# EAGLE schematic 612_jetracer_328_211 (EAGLE 9.6.0)
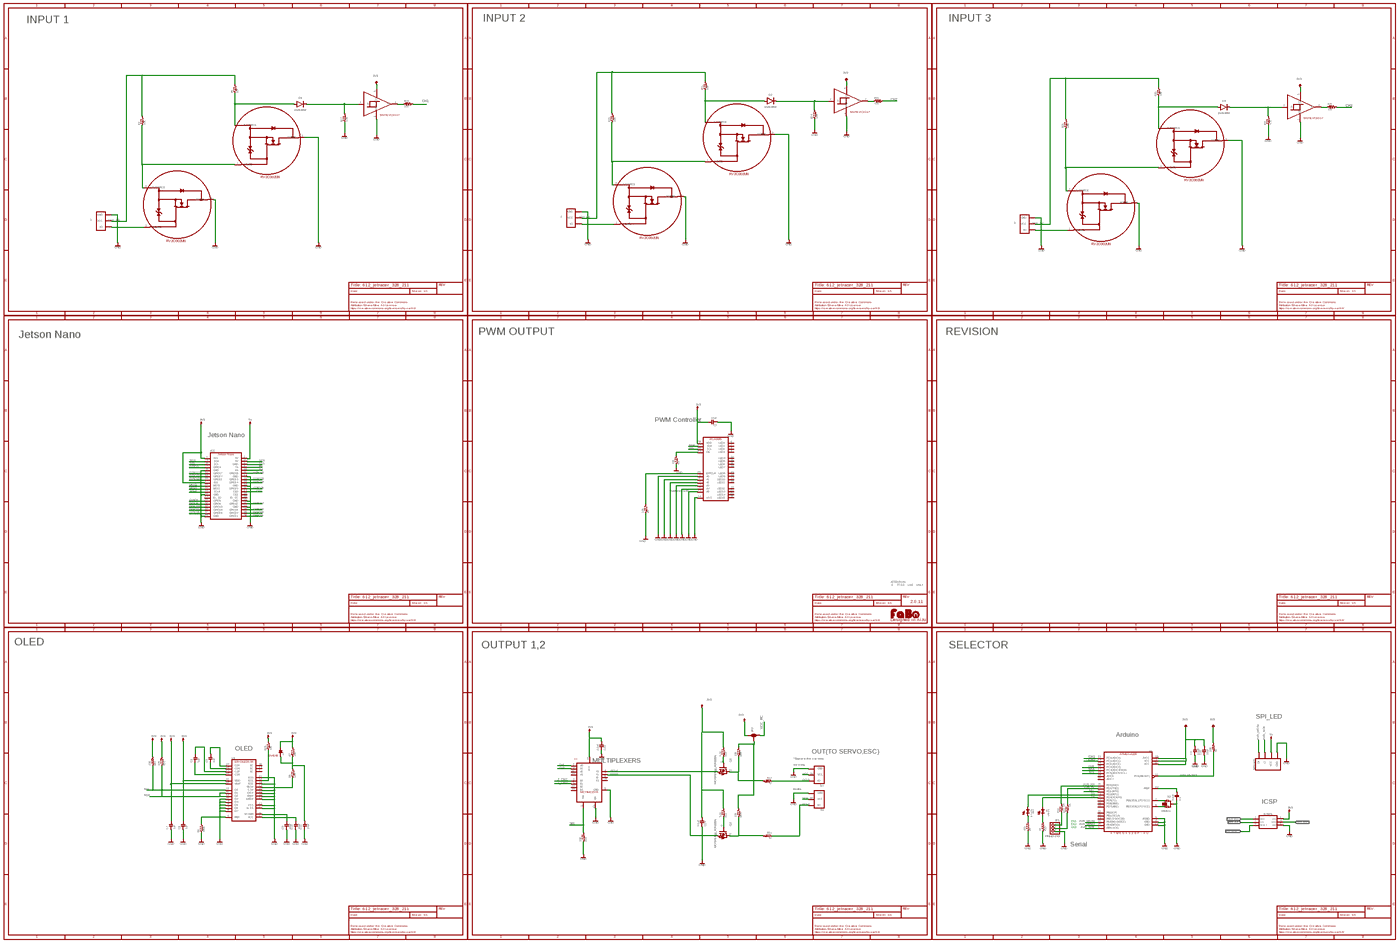
[diagram p0: schematic, sheet 1, overview]
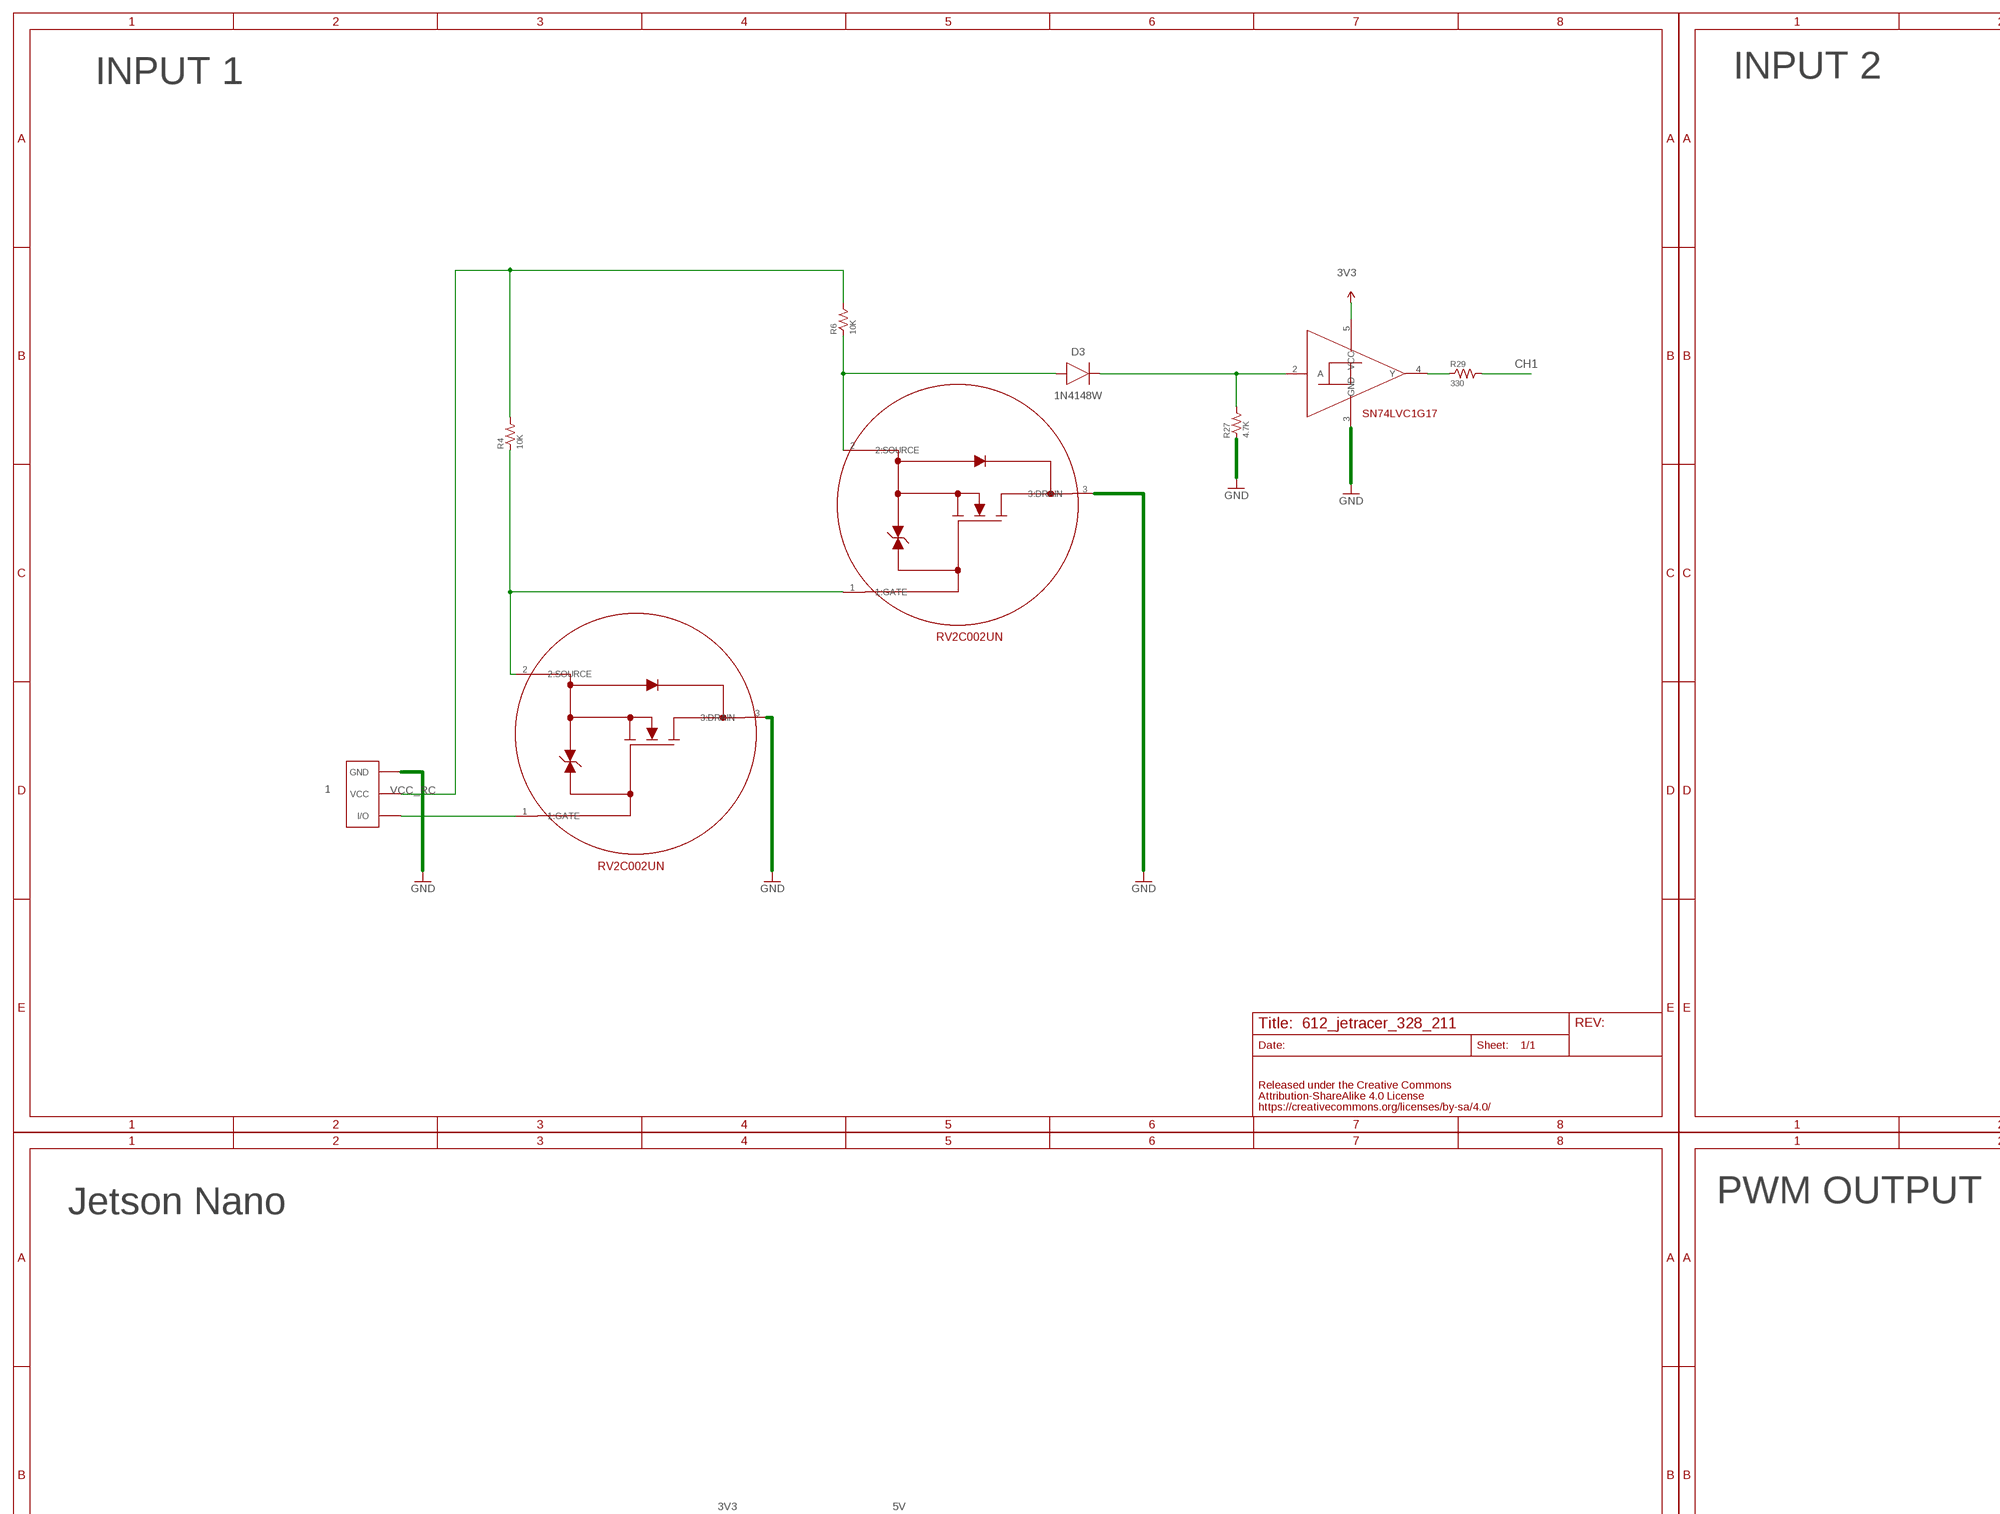
[diagram p1: schematic, sheet 1, part 1 of 6]
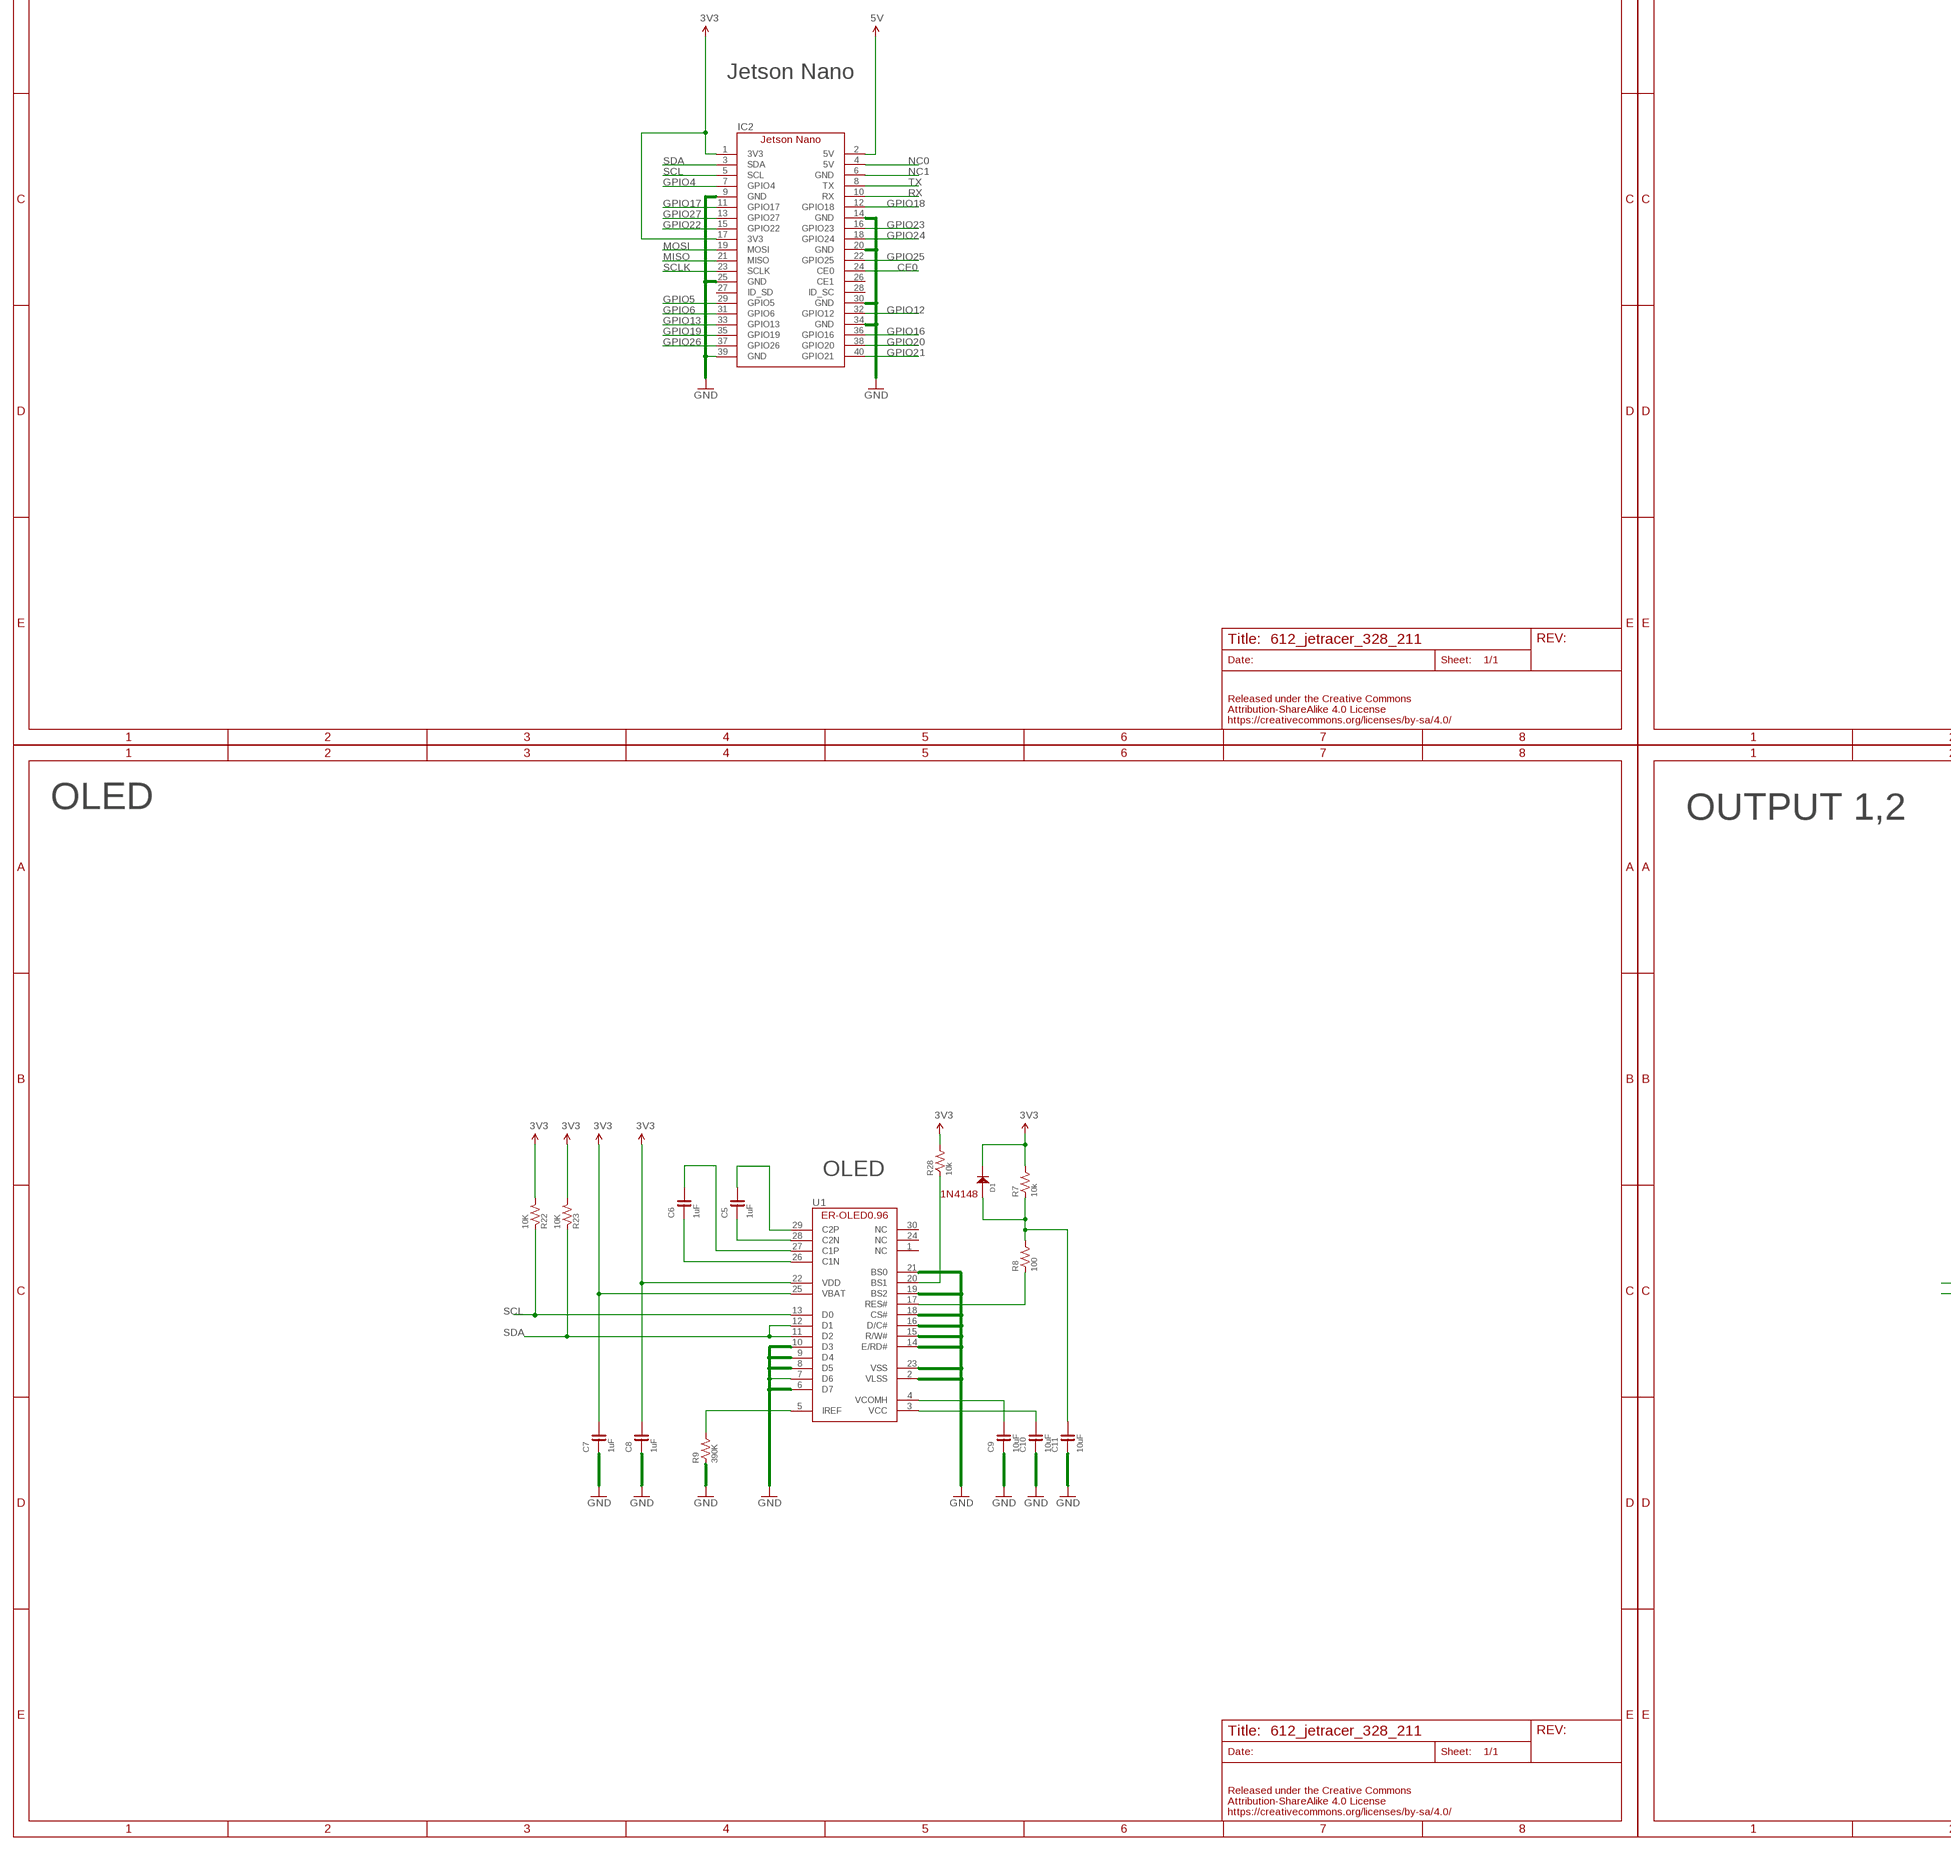
[diagram p2: schematic, sheet 1, part 2 of 6]
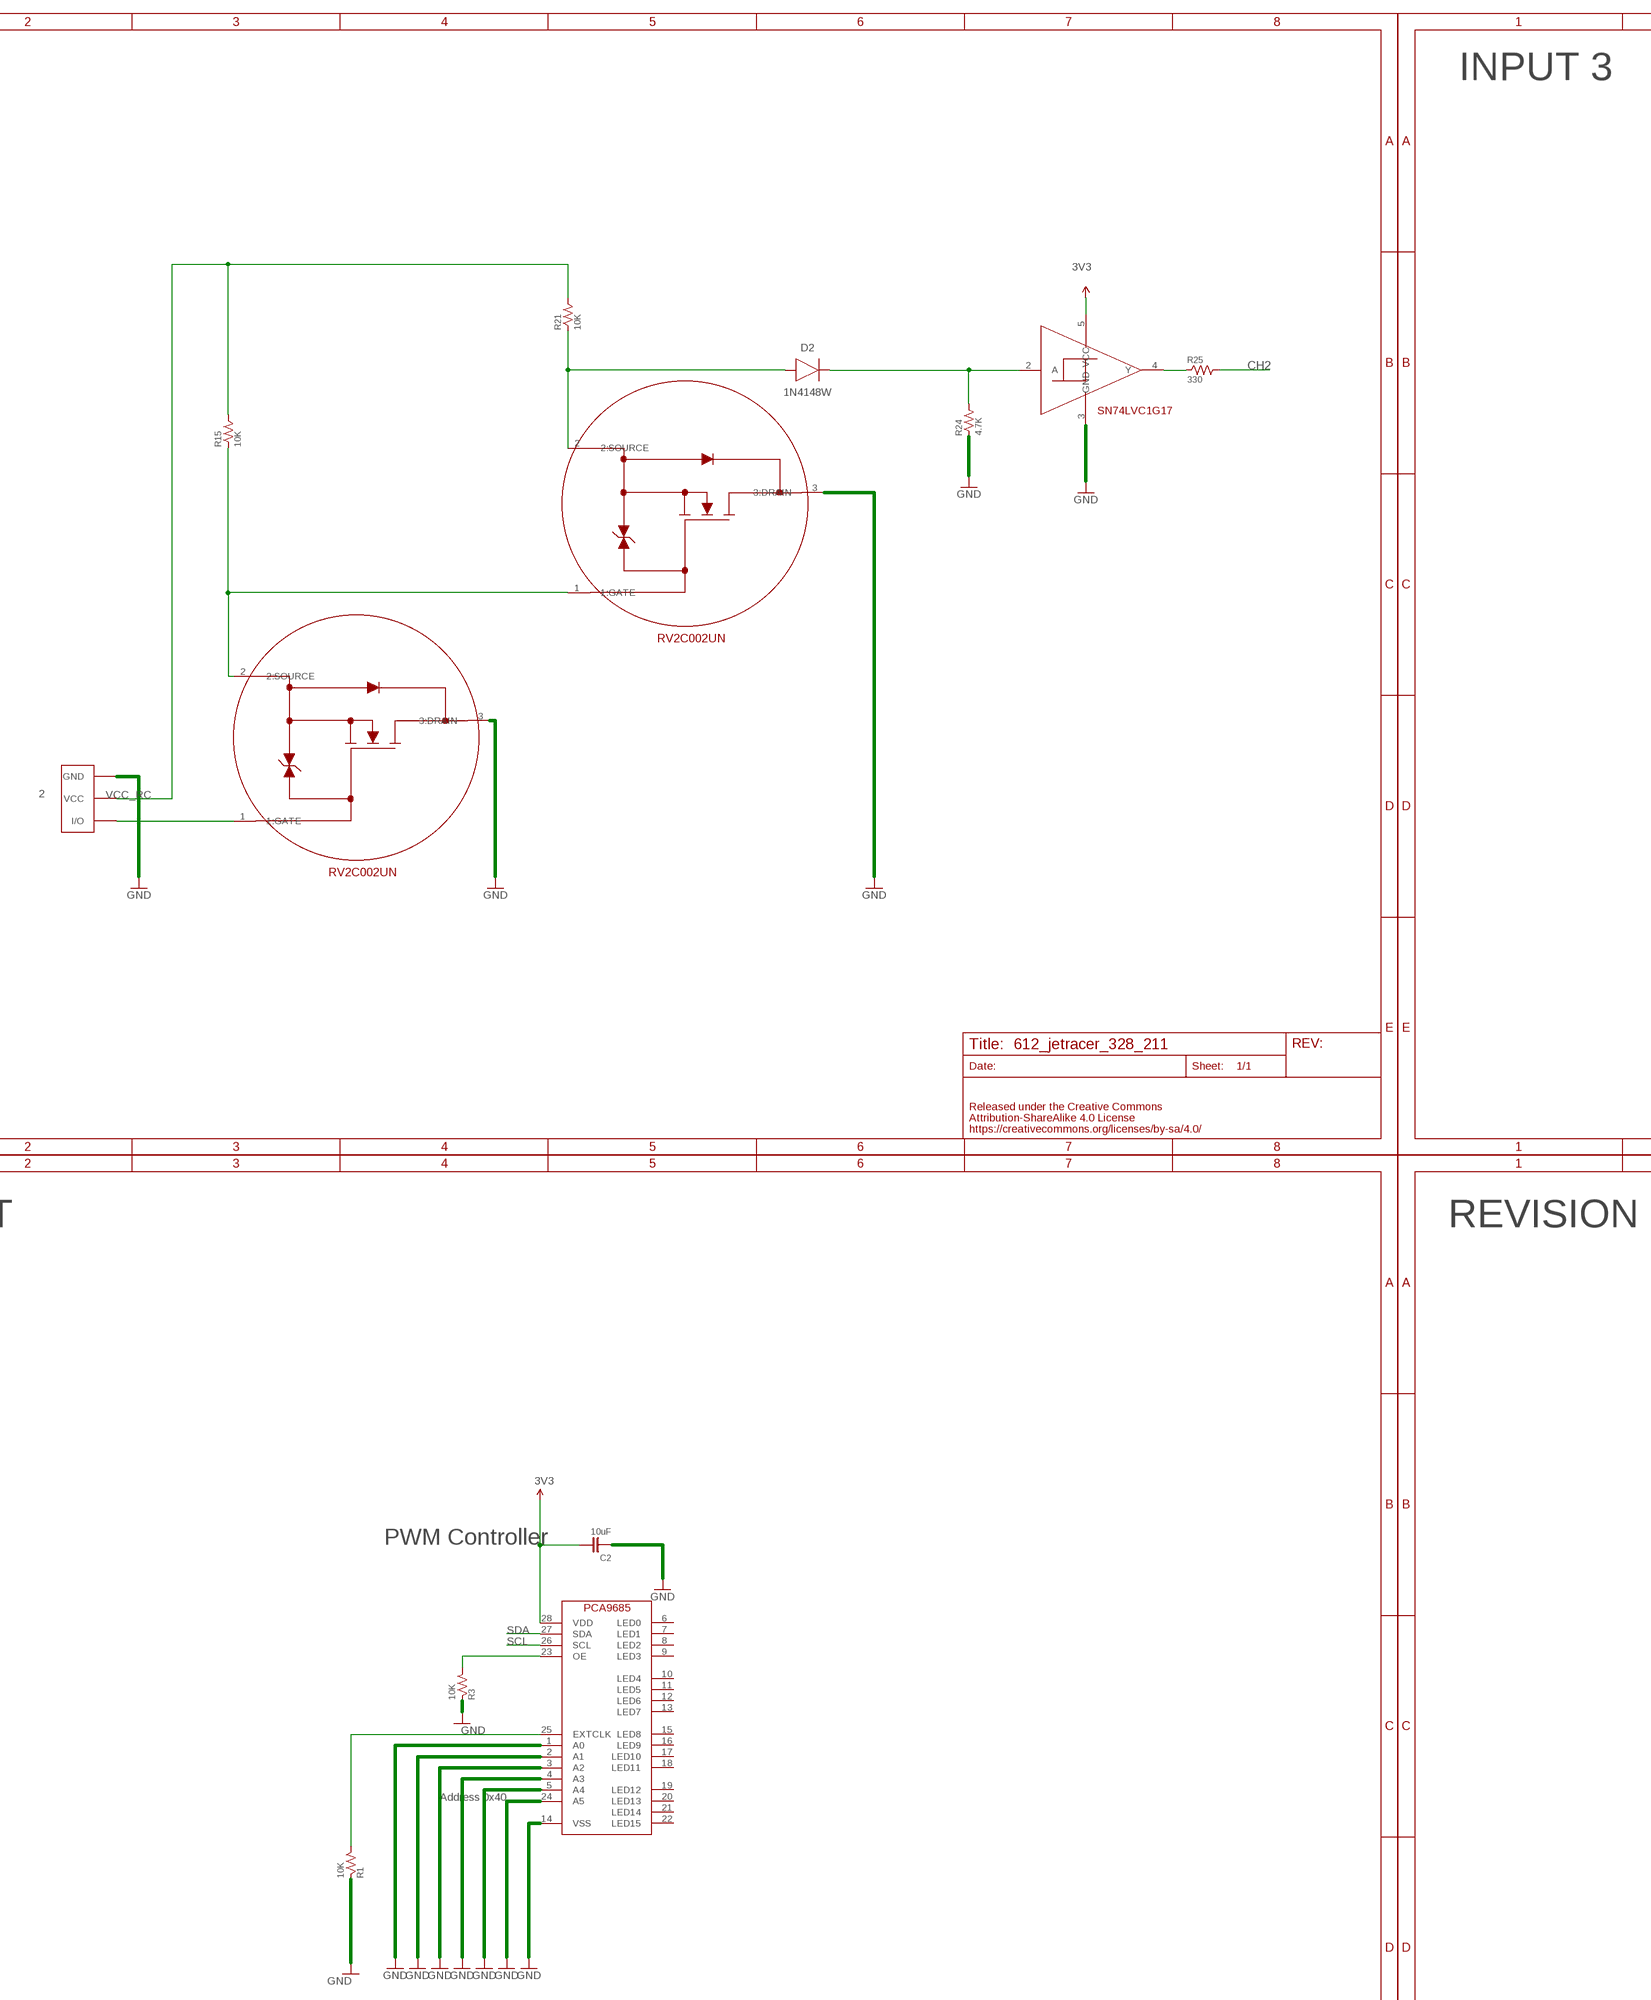
[diagram p3: schematic, sheet 1, part 3 of 6]
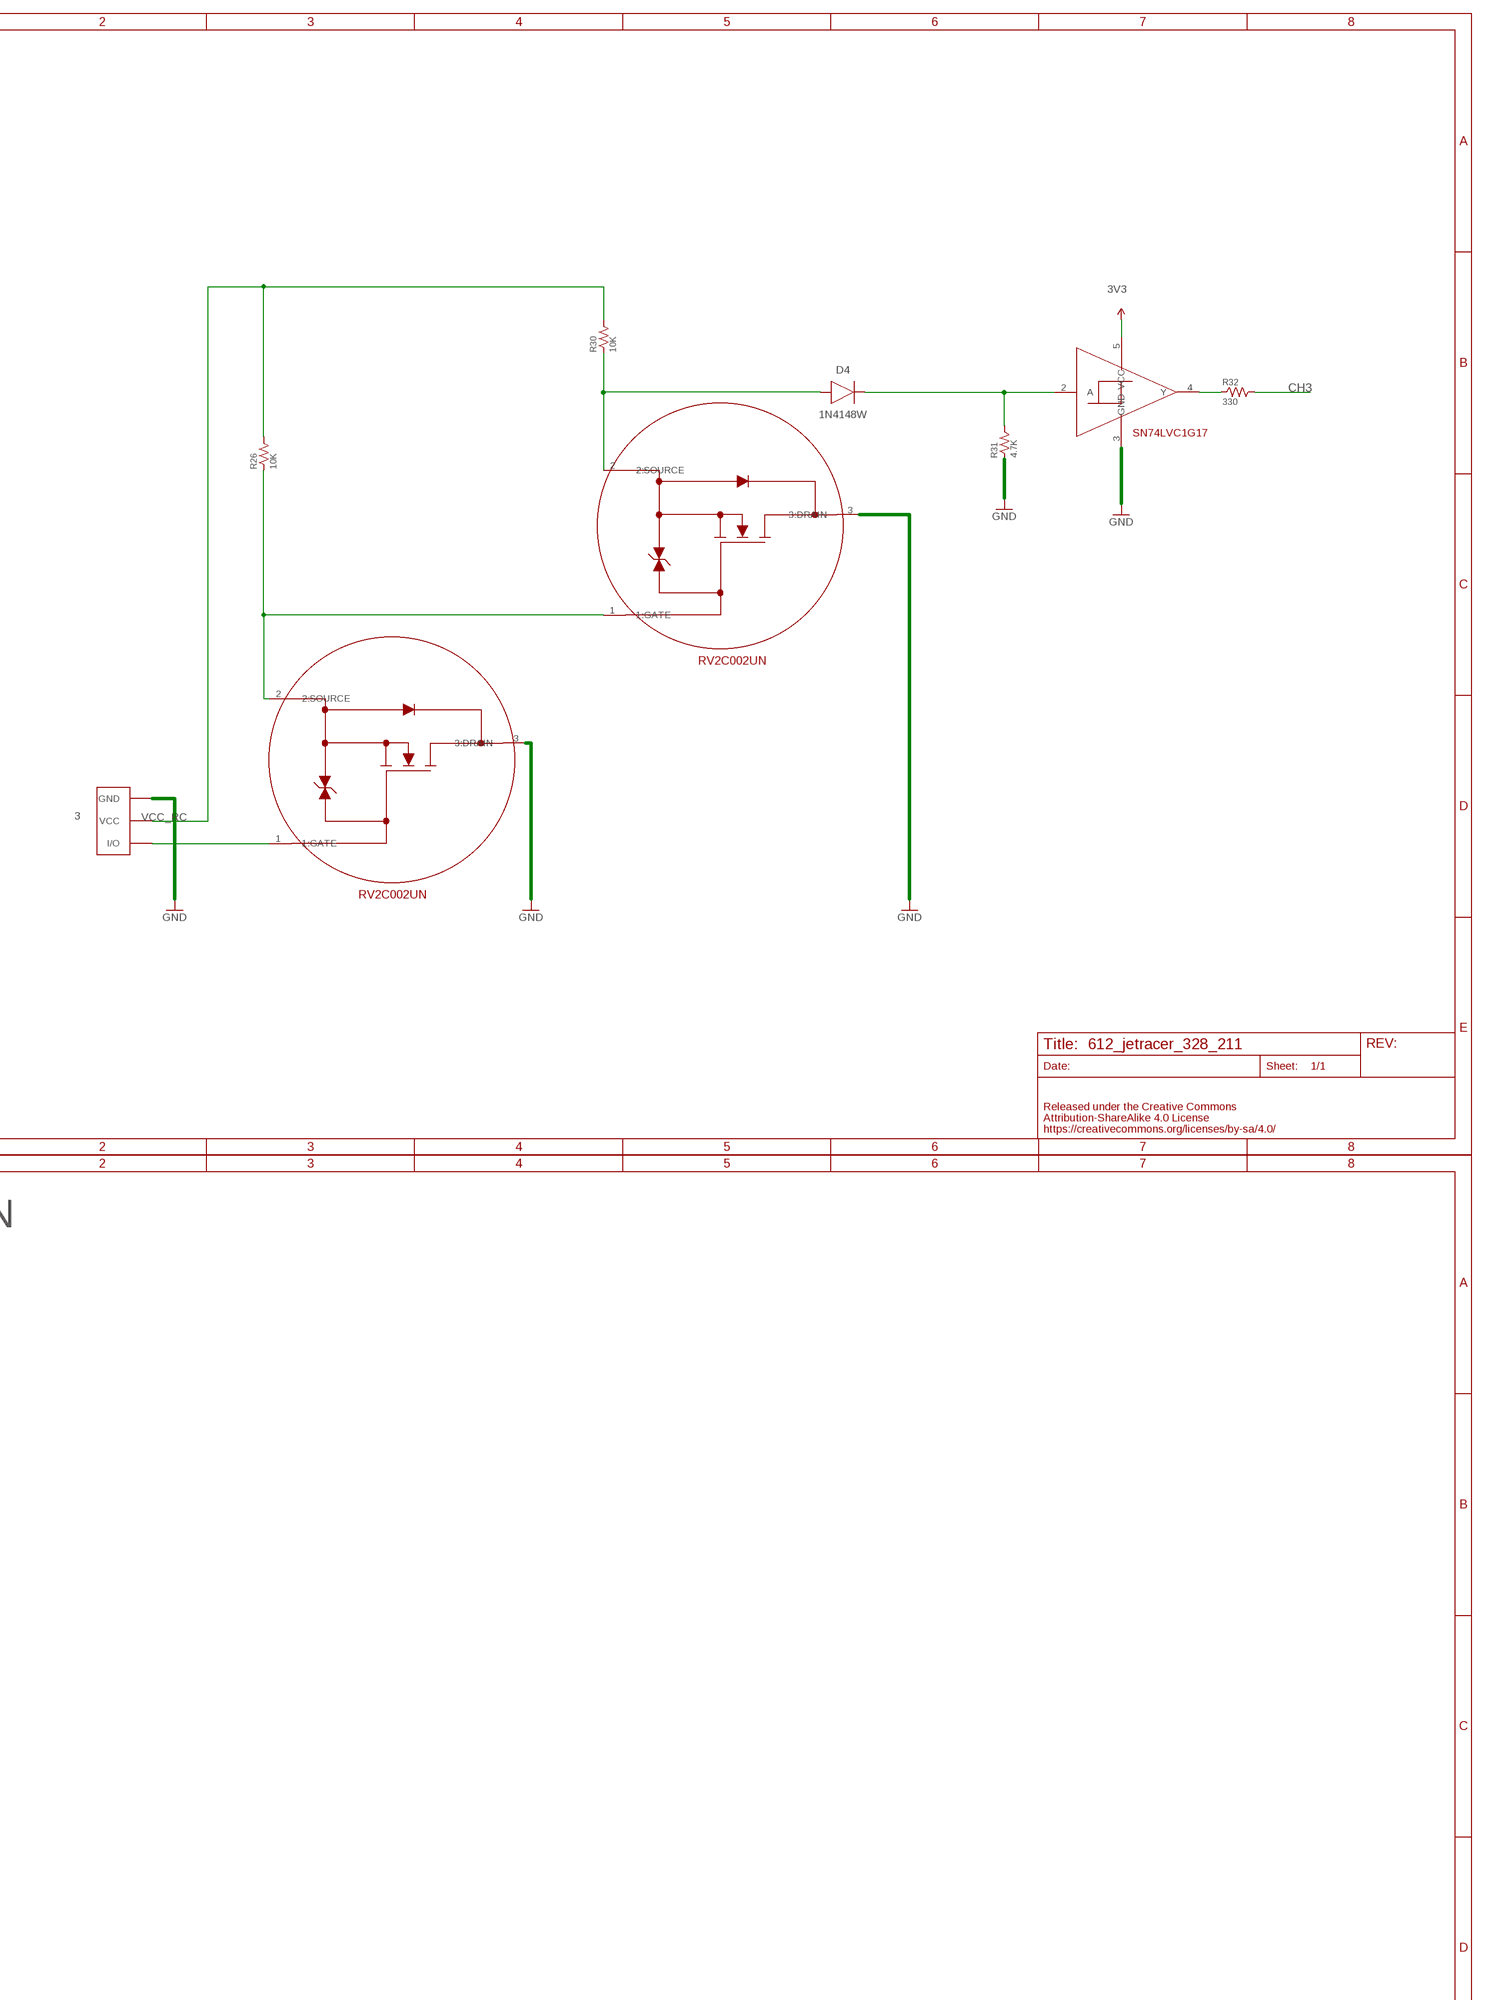
[diagram p4: schematic, sheet 1, part 4 of 6]
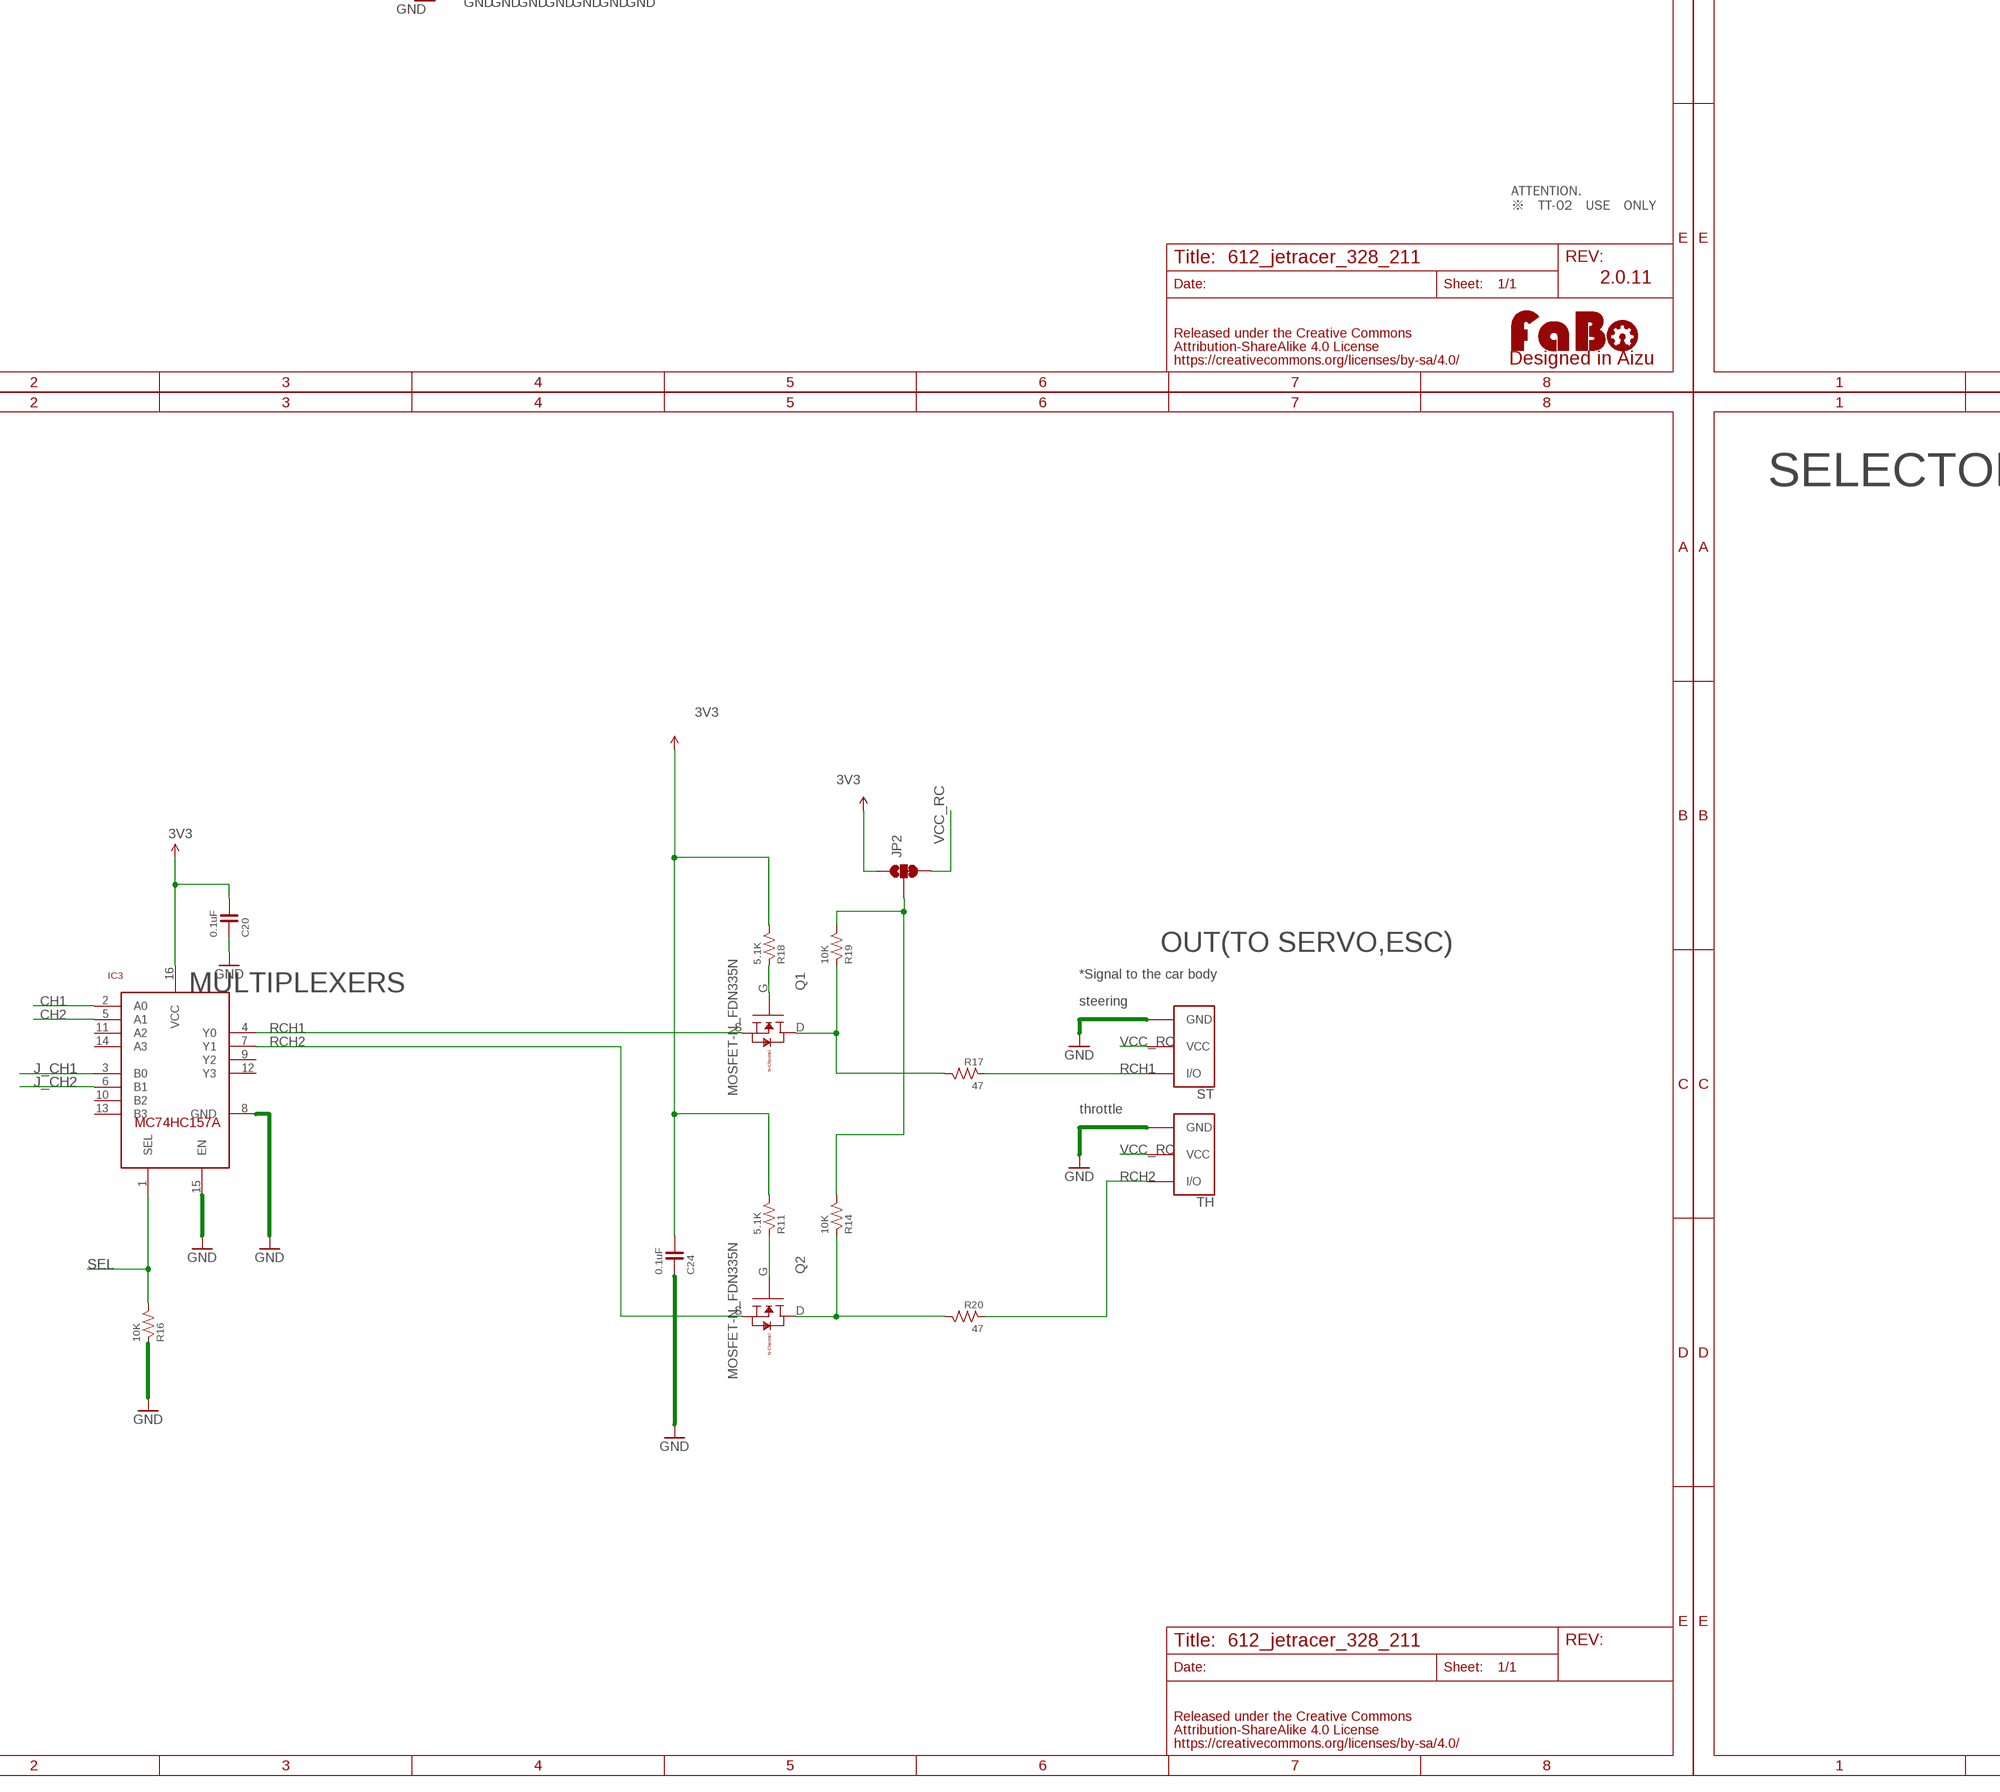
[diagram p5: schematic, sheet 1, part 5 of 6]
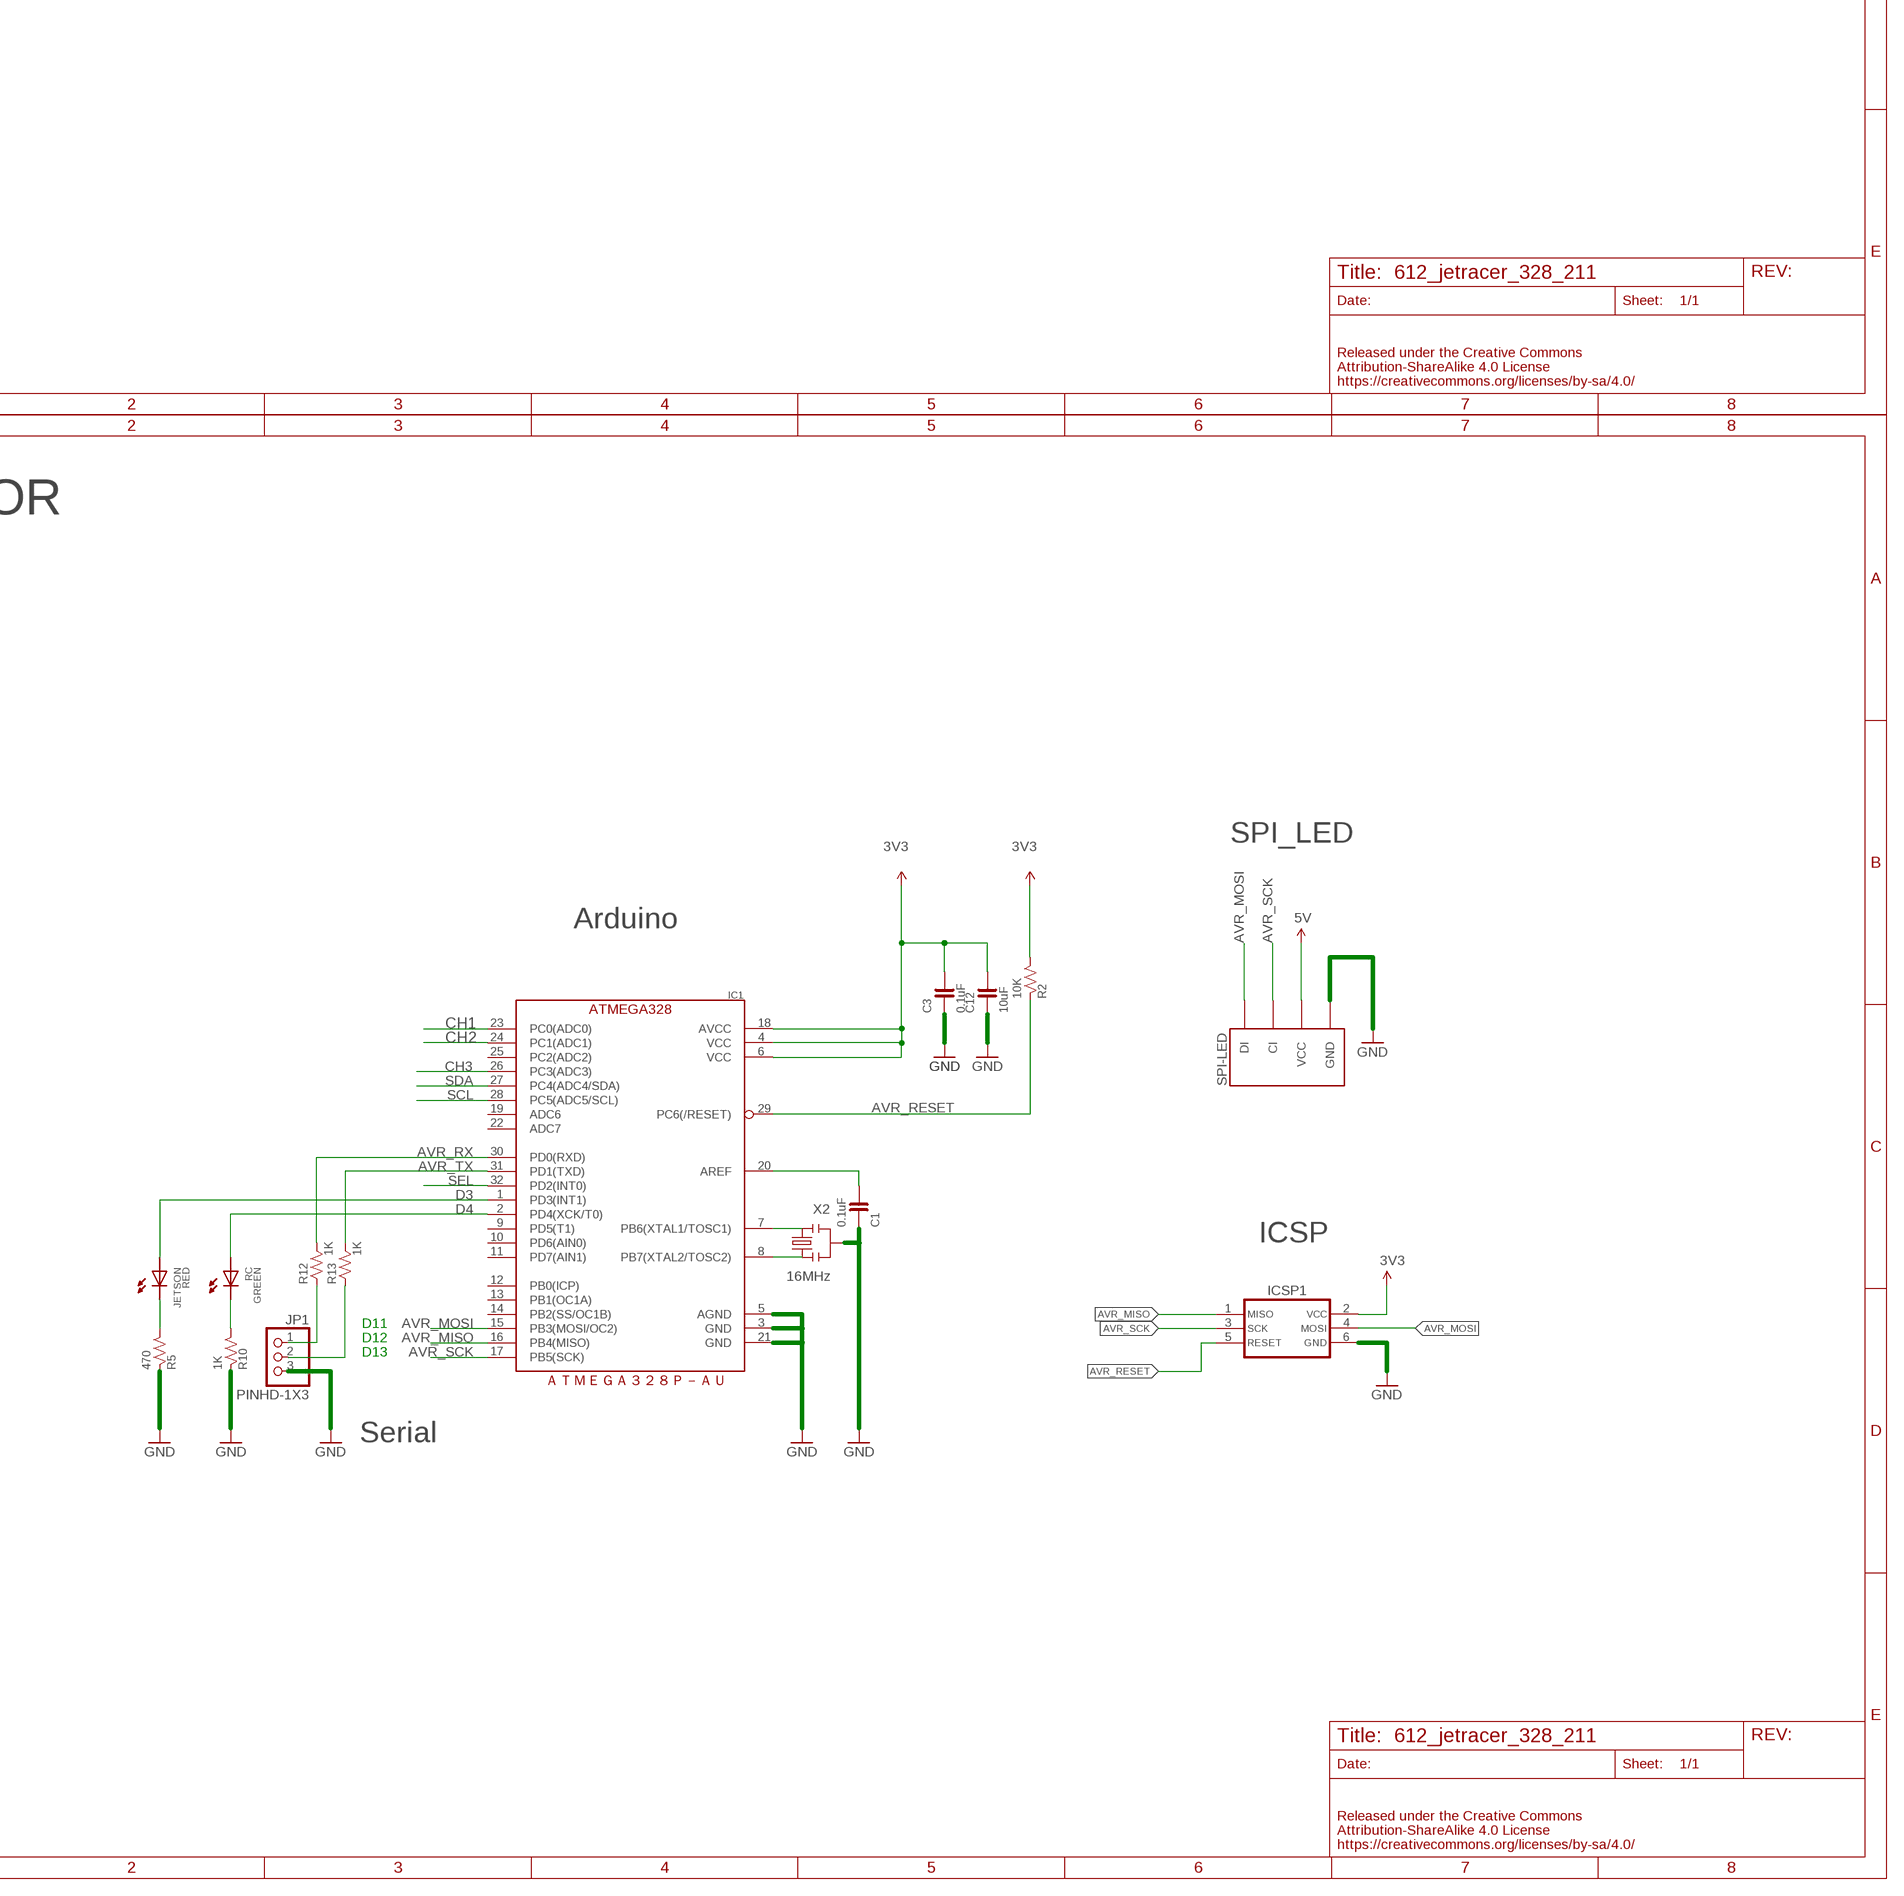
[diagram p6: schematic, sheet 1, part 6 of 6]

## Parts
1  FABO_BRICK_3PIN-HEADER  [FABO_BRICK_3PIN_HEADER]
2  FABO_BRICK_3PIN-HEADER  [FABO_BRICK_3PIN_HEADER]
3  FABO_BRICK_3PIN-HEADER  [FABO_BRICK_3PIN_HEADER]
C1  0.1uF  CAPACITOR-0603  [0603]
C2  10uF  CAPACITOR-0603  [0603]
C3  0.1uF  CAPACITOR-0603-BOTTOM  [0603-BOTTOM]
C5  1uF  CAPACITOR-0603-BOTTOM  [0603-BOTTOM]
C6  1uF  CAPACITOR-0603-BOTTOM  [0603-BOTTOM]
C7  1uF  CAPACITOR-0603-BOTTOM  [0603-BOTTOM]
C8  1uF  CAPACITOR-0603-BOTTOM  [0603-BOTTOM]
C9  10uF  CAPACITOR-0603-BOTTOM  [0603-BOTTOM]
C10  10uF  CAPACITOR-0603-BOTTOM  [0603-BOTTOM]
C11  10uF  CAPACITOR-0603-BOTTOM  [0603-BOTTOM]
C12  10uF  CAPACITOR-0603-BOTTOM  [0603-BOTTOM]
C20  0.1uF  CAPACITOR-0603  [0603]
C24  0.1uF  CAPACITOR-0603  [0603]
D1  1N4148  [1N4148W]
D2  1N4148W  DIODE_1N4148W-7-F_SOD123G  [SOD3715X135]
D3  1N4148W  DIODE_1N4148W-7-F_SOD123G  [SOD3715X135]
D4  1N4148W  DIODE_1N4148W-7-F_SOD123G  [SOD3715X135]
IC1  ATMEGA328P-AU  [TQFP-32]
IC2  JETSON_NANO_NOBORDER  [JETSON_NANO_NOBOARDER]
IC3  MULTIPLEXERSMC74HC157A  [TSSOP-16]
IC4  PCA9685  [PCA9685]
ICSP1  ICSP_AVR-TC_NOHOLE  [TC2030]
JETSON  GREEN  LED-0603  [0603]
JP1  PINHD-1X3  [1X03]
JP2  JUMPER-SMT_3_1-NC_TRACE_SILK  [SMT-JUMPER_3_1-NC_TRACE_SILK]
Q1  MOSFET-N_FDN335N  [SUPERSOT-3]
Q2  MOSFET-N_FDN335N  [SUPERSOT-3]
R1  10K  RESISTOR-0603  [0603]
R2  10K  RESISTOR-0603  [0603]
R3  10K  RESISTOR-0603  [0603]
R4  10K  RESISTOR-0603  [0603]
R5  470  RESISTOR-0603  [0603]
R6  10K  RESISTOR-0603  [0603]
R7  10k  RESISTOR-0603-BOTTOM  [0603-BOTTOM]
R8  100  RESISTOR-0603-BOTTOM  [0603-BOTTOM]
R9  390K  RESISTOR-0603-BOTTOM  [0603-BOTTOM]
R10  1K  RESISTOR-0603  [0603]
R11  5.1K  RESISTOR-0603  [0603]
R12  1K  RESISTOR-0603  [0603]
R13  1K  RESISTOR-0603  [0603]
R14  10K  RESISTOR-0603  [0603]
R15  10K  RESISTOR-0603  [0603]
R16  10K  RESISTOR-0603  [0603]
R17  47  RESISTOR-0603  [0603]
R18  5.1K  RESISTOR-0603  [0603]
R19  10K  RESISTOR-0603  [0603]
R20  47  RESISTOR-0603  [0603]
R21  10K  RESISTOR-0603  [0603]
R22  10K  RESISTOR-0603  [0603]
R23  10K  RESISTOR-0603  [0603]
R24  4.7K  RESISTOR-0603  [0603]
R25  330  RESISTOR-0603  [0603]
R26  10K  RESISTOR-0603  [0603]
R27  4.7K  RESISTOR-0603  [0603]
R28  10k  RESISTOR-0603-BOTTOM  [0603-BOTTOM]
R29  330  RESISTOR-0603  [0603]
R30  10K  RESISTOR-0603  [0603]
R31  4.7K  RESISTOR-0603  [0603]
R32  330  RESISTOR-0603  [0603]
RC  RED  LED-0603  [0603]
SPI-LED  FABO-SPI-LED-B04B  [SPI-B04B-PASK-1]
ST  FABO_BRICK_3PIN-HEADER  [FABO_BRICK_3PIN_HEADER]
TH  FABO_BRICK_3PIN-HEADER  [FABO_BRICK_3PIN_HEADER]
U1  ER-OLED0.96-1ER-CON30HT-1  [ER-CON30HT-1]
U$1  RV2C002UN  [DFN1006-3]
U$2  RV2C002UN  [DFN1006-3]
U$3  RV2C002UN  [DFN1006-3]
U$5  RV2C002UN  [DFN1006-3]
U$6  SN74LVC1G17  [SOT-23]
U$7  RV2C002UN  [DFN1006-3]
U$8  RV2C002UN  [DFN1006-3]
U$9  SN74LVC1G17  [SOT-23]
U$11  LOGO_FABO-M  [LOGO_FABO_MS]
U$14  SN74LVC1G17  [SOT-23]
X2  16MHz  RESONATOR  [CSTNE_V_C]

## Nets
3V3: C2.2 C3.2 C7.2 C8.2 C12.2 C20.2 C24.2 D1.CATHODE IC1.4(VCC) IC1.6(VCC) IC1.18(AVCC) IC2.1(3V3) IC2.17(3V3) IC3.16(VCC) IC4.28(VDD) ICSP1.2 JP2.1 R2.2 R7.2 R11.2 R18.2 R22.2 R23.2 R28.2 U1.22(VDD) U1.25(VBAT) U$6.5(VCC) U$9.5(VCC) U$14.5(VCC)
5V: IC2.2(5V) SPI-LED.VCC
AVR_MISO: IC1.16(PB4(MISO)) ICSP1.1
AVR_MOSI: IC1.15(PB3(MOSI/OC2)) ICSP1.4 SPI-LED.DI
AVR_RESET: IC1.29(PC6(/RESET)) ICSP1.5 R2.1
AVR_RX: IC1.30(PD0(RXD)) R12.2
AVR_SCK: IC1.17(PB5(SCK)) ICSP1.3 SPI-LED.CI
AVR_TX: IC1.31(PD1(TXD)) R13.2
CE0: IC2.24(CE0)
CH1: IC1.23(PC0(ADC0)) IC3.2(A0) R29.2
CH2: IC1.24(PC1(ADC1)) IC3.5(A1) R25.2
CH3: IC1.26(PC3(ADC3)) R32.2
D3: IC1.1(PD3(INT1)) RC.ANODE
D4: IC1.2(PD4(XCK/T0)) JETSON.ANODE
GND: 1.GND 2.GND 3.GND C1.1 C2.1 C3.1 C7.1 C8.1 C9.1 C10.1 C11.1 C12.1 C20.1 C24.1 IC1.3(GND) IC1.5(AGND) IC1.21(GND) IC2.9(GND) IC2.14(GND) IC2.20(GND) IC2.25(GND) IC2.30(GND) IC2.34(GND) IC2.39(GND) IC3.8(GND) IC3.15(EN) IC4.1(A0) IC4.2(A1) IC4.3(A2) IC4.4(A3) IC4.5(A4) IC4.14(VSS) IC4.24(A5) ICSP1.6 JP1.3 R1.1 R3.1 R5.1 R9.1 R10.1 R16.1 R24.1 R27.1 R31.1 SPI-LED.GND ST.GND TH.GND U1.2(VLSS) U1.6(D7) U1.7(D6) U1.8(D5) U1.9(D4) U1.10(D3) U1.14(E/RD#) U1.15(R/W#) U1.16(D/C#) U1.18(CS#) U1.19(BS2) U1.21(BS0) U1.23(VSS) U$1.3(3:DRAIN) U$2.3(3:DRAIN) U$3.3(3:DRAIN) U$5.3(3:DRAIN) U$6.3(GND) U$7.3(3:DRAIN) U$8.3(3:DRAIN) U$9.3(GND) U$14.3(GND) X2.2
GPIO4: IC2.7(GPIO4)
GPIO5: IC2.29(GPIO5)
GPIO6: IC2.31(GPIO6)
GPIO12: IC2.32(GPIO12)
GPIO13: IC2.33(GPIO13)
GPIO16: IC2.36(GPIO16)
GPIO17: IC2.11(GPIO17)
GPIO18: IC2.12(GPIO18)
GPIO19: IC2.35(GPIO19)
GPIO20: IC2.38(GPIO20)
GPIO21: IC2.40(GPIO21)
GPIO22: IC2.15(GPIO22)
GPIO23: IC2.16(GPIO23)
GPIO24: IC2.18(GPIO24)
GPIO25: IC2.22(GPIO25)
GPIO26: IC2.37(GPIO26)
GPIO27: IC2.13(GPIO27)
J_CH1: IC3.3(B0)
J_CH2: IC3.6(B1)
MISO: IC2.21(MISO)
MOSI: IC2.19(MOSI)
N$1: 1.I/O U$1.1(1:GATE)
N$2: R4.1 U$1.2(2:SOURCE) U$2.1(1:GATE)
N$3: Q1.D R17.2 R19.1
N$4: C1.2 IC1.20(AREF)
N$5: IC1.8(PB7(XTAL2/TOSC2)) X2.3
N$6: JP1.1 R12.1
N$7: IC4.23(OE) R3.2
N$8: IC4.25(EXTCLK) R1.2
N$9: Q2.D R14.1 R20.2
N$10: R17.1 ST.I/O
N$11: D3.2(A) R6.1 U$2.2(2:SOURCE)
N$12: 2.I/O U$3.1(1:GATE)
N$13: R15.1 U$3.2(2:SOURCE) U$5.1(1:GATE)
N$14: R20.1 TH.I/O
N$15: IC1.7(PB6(XTAL1/TOSC1)) X2.1
N$16: C6.2 U1.27(C1P)
N$17: JP1.2 R13.1
N$18: D2.2(A) R21.1 U$5.2(2:SOURCE)
N$19: R5.2 RC.CATHODE
N$20: JETSON.CATHODE R10.2
N$21: C6.1 U1.26(C1N)
N$22: C5.1 U1.28(C2N)
N$23: C5.2 U1.29(C2P)
N$24: R9.2 U1.5(IREF)
N$25: C9.2 U1.4(VCOMH)
N$26: C10.2 U1.3(VCC)
N$27: R8.1 U1.17(RES#)
N$28: C11.2 D1.ANODE R7.1 R8.2
N$29: D2.1(C) R24.2 U$6.2(A)
N$30: R25.1 U$6.4(Y)
N$31: 3.I/O U$7.1(1:GATE)
N$32: R26.1 U$7.2(2:SOURCE) U$8.1(1:GATE)
N$33: D4.2(A) R30.1 U$8.2(2:SOURCE)
N$34: D3.1(C) R27.2 U$14.2(A)
N$35: R29.1 U$14.4(Y)
N$36: D4.1(C) R31.2 U$9.2(A)
N$37: R32.1 U$9.4(Y)
N$38: JP2.2 R14.2 R19.2
N$39: Q2.G R11.1
N$40: Q1.G R18.1
N$50: R28.1 U1.20(BS1)
NC0: IC2.4(5V)
NC1: IC2.6(GND)
RCH1: IC3.4(Y0) Q1.S
RCH2: IC3.7(Y1) Q2.S
RX: IC2.10(RX)
SCL: IC1.28(PC5(ADC5/SCL)) IC2.5(SCL) IC4.26(SCL) R22.1 U1.13(D0)
SCLK: IC2.23(SCLK)
SDA: IC1.27(PC4(ADC4/SDA)) IC2.3(SDA) IC4.27(SDA) R23.1 U1.11(D2) U1.12(D1)
SEL: IC1.32(PD2(INT0)) IC3.1(SEL) R16.2
TX: IC2.8(TX)
VCC_RC: 1.VCC 2.VCC 3.VCC JP2.3 R4.2 R6.2 R15.2 R21.2 R26.2 R30.2 ST.VCC TH.VCC
Unconnected: IC1.9(PD5(T1)) IC1.10(PD6(AIN0)) IC1.11(PD7(AIN1)) IC1.12(PB0(ICP)) IC1.13(PB1(OC1A)) IC1.14(PB2(SS/OC1B)) IC1.19(ADC6) IC1.22(ADC7) IC1.25(PC2(ADC2)) IC2.26(CE1) IC2.27(ID_SD) IC2.28(ID_SC) IC3.9(Y2) IC3.10(B2) IC3.11(A2) IC3.12(Y3) IC3.13(B3) IC3.14(A3) IC4.6(LED0) IC4.7(LED1) IC4.8(LED2) IC4.9(LED3) IC4.10(LED4) IC4.11(LED5) IC4.12(LED6) IC4.13(LED7) IC4.15(LED8) IC4.16(LED9) IC4.17(LED10) IC4.18(LED11) IC4.19(LED12) IC4.20(LED13) IC4.21(LED14) IC4.22(LED15) U1.1(NC) U1.24(NC) U1.30(NC)

## Notes on the sheet
- INPUT 1 | INPUT 2 | INPUT 3
- SN74LVC1G17
- SN74LVC1G17
- SN74LVC1G17
- RV2C002UN
- RV2C002UN
- RV2C002UN
- RV2C002UN
- RV2C002UN
- RV2C002UN
- Jetson Nano | PWM OUTPUT | REVISION
- PWM Controller
- Jetson Nano
- Address 0x40
- ATTENTION.
  ※　TT-02　USE　ONLY
- 2.0.11
- OLED | OUTPUT 1,2 | SELECTOR
- SPI_LED
- Arduino
- OLED
- OUT(TO SERVO,ESC)
- 1N4148
- *Signal to the car body
- MULTIPLEXERS
- steering
- throttle
- MC74HC157A
- ICSP
- D11
- D12
- D13
- ＡＴＭＥＧＡ３２８Ｐ－ＡＵ
- Serial

## Library data of the parts
1-3 ST TH = FaBo-Template:FABO_BRICK_3PIN: FaBo Brick 3pin
C1-C3 C5-C12 C20 = FaBo-Capacitor:CAPACITOR: CAPACITOR
C24 = FaBo-Capacitor:CAPACITOR: CAPACITOR; SPICEPREFIX: C
D1 = FaBo-Diode:1N4148
D2-D4 = Diode:DIODE_: Diode Rectifier - Popular parts; CATEGORY: Diode; DESCRIPTION: DIODE GEN PURP 100V 300MA SOD123; MANUFACTURER: Diodes Incorporated; SUB-CATEGORY: Rectifier
IC1 = component:ATMEGA328
IC2 = FaBo-Boards:JETSON_NANO
IC3 = FaBo-Multiplexers:MULTIPLEXERS
IC4 = FaBo-Motor:PCA9685
ICSP1 = component:ICSP_AVR
JETSON RC = FaBo-LED:LED
JP1 = Connector:PINHD-1X3: PIN HEADER; CATEGORY: CONNECTOR; SUB-CATEGORY: PIN-HEADER
JP2 = SparkFun-Jumpers:JUMPER-SMT_3_1-NC_TRACE: Normally closed trace jumper (1 of 2 connections) This jumper has a trace between two pads so it's normally closed (NC). The other connection is normally open (NO). Use a razor knife to open the connection. For best results follow the IPC guidelines for cutting traces: Cutout at least 0.063 mm (0.005 in). Remove all loose material to clean up the cut area. Seal the cut with an approved epoxy. Reapply solder to reclose the connection, or to close the NO connection.
Q1 Q2 = FaBo-Mosfet:MOSFET-N
R1-R32 = FaBo-Resistors:RESISTOR: RESISTOR
SPI-LED = FaBo-Connetor:FABO-SPI-LED
U1 = FaBo-Display:ER-OLED0.96-1
U$1-U$3 U$5 U$7 U$8 = FaBo-Mosfet:RV2C002UN
U$6 U$9 U$14 = FaBo-LogicIC:SN74LVC1G17
U$11 = FaBo-Logo:LOGO_FABO
X2 = component:RESONATOR